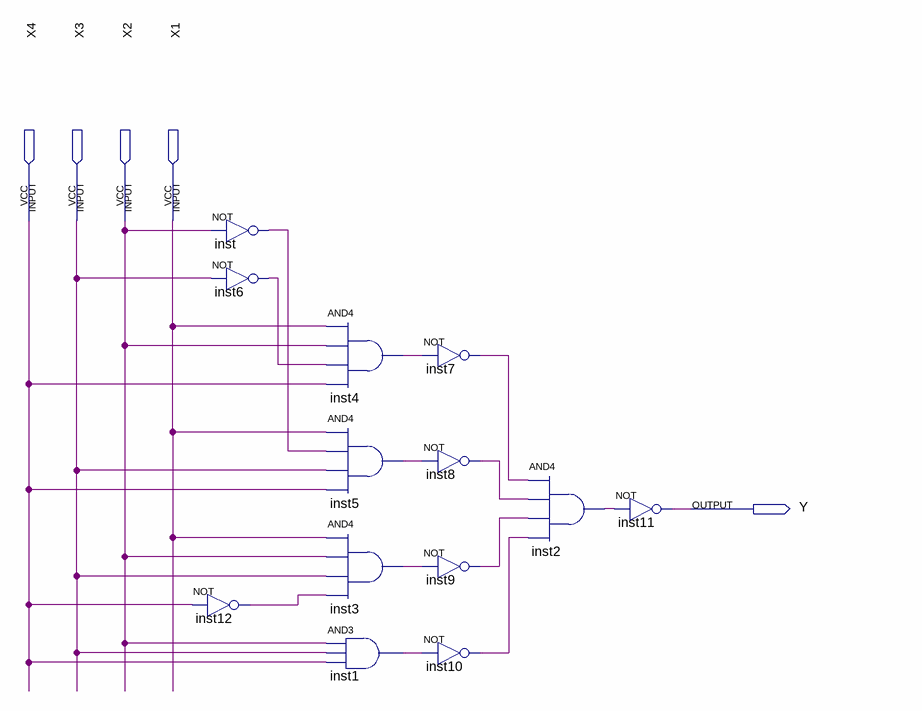
[diagram p0: schematic sheet]
// Quartus schematic v3_3.bdf as structural Verilog: 13 symbols, 5 pins
module v3_3 (
  input  X4,
  input  X3,
  input  X2,
  input  X1,
  output Y
);

  wire inst1_out, inst2_out, inst3_out, inst4_out, inst5_out, inst6_out, inst7_out, inst8_out, inst9_out,
       inst10_out, inst12_out, inst_out;

  not inst12 (inst12_out, X4);
  not inst (inst_out, X2);
  not inst6 (inst6_out, X3);
  and inst4 (inst4_out, X1, X2, inst6_out, X4);
  and inst5 (inst5_out, X1, inst_out, X3, X4);
  and inst3 (inst3_out, X1, X2, X3, inst12_out);
  and inst1 (inst1_out, X2, X3, X4);
  not inst7 (inst7_out, inst4_out);
  not inst8 (inst8_out, inst5_out);
  not inst9 (inst9_out, inst3_out);
  not inst10 (inst10_out, inst1_out);
  and inst2 (inst2_out, inst7_out, inst8_out, inst9_out, inst10_out);
  not inst11 (Y, inst2_out);
endmodule
